# Altium schematic sheet Power Regulator.SchDoc: System Power Regulators & GSM IoT Power Switch
size A4; SheetNumber: 11; SheetTotal: 37
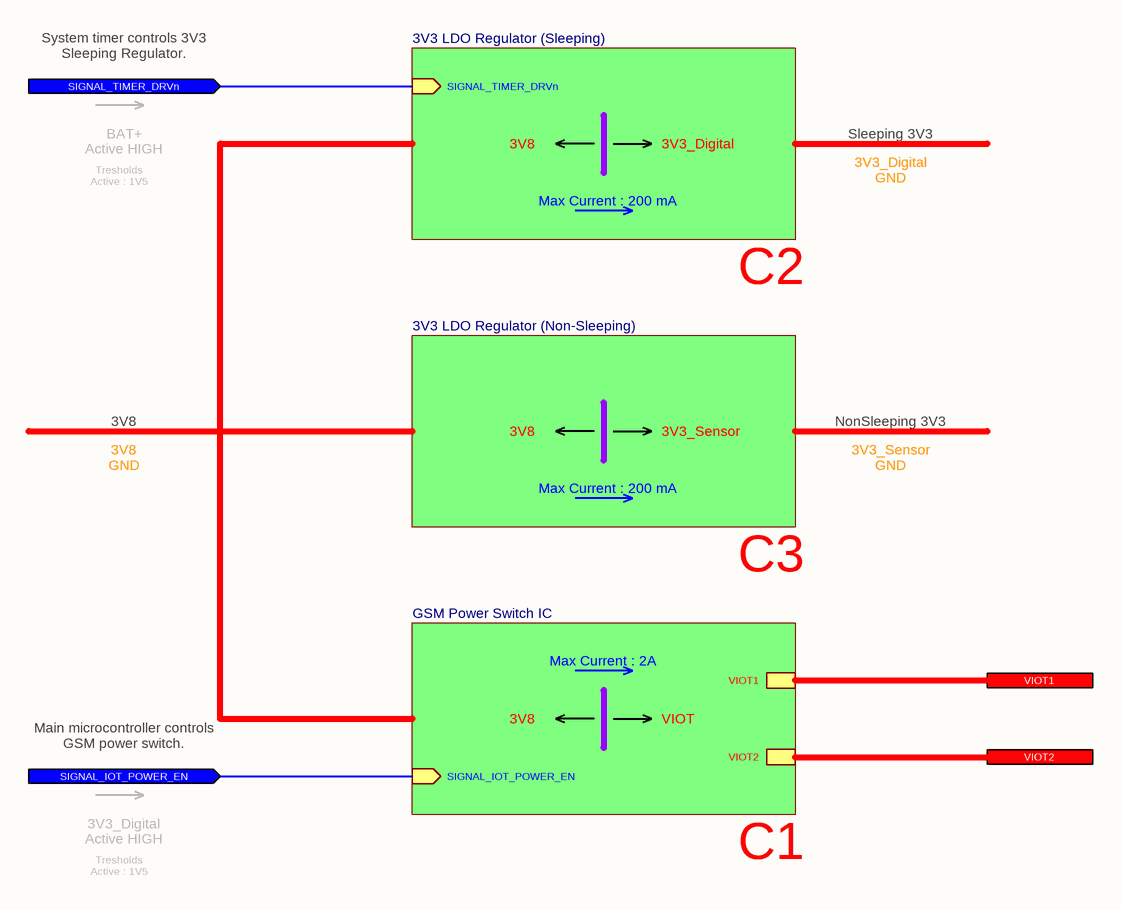
[diagram p0: Power Regulator.SchDoc]

## Sub-sheets
3V3 LDO Regulator (Non-Sleeping) = 3V3 LDO Regulator (NonSleeping).SchDoc: no entries
3V3 LDO Regulator (Sleeping) = 3V3 LDO Regulator (Sleeping).SchDoc: SIGNAL_TIMER_DRVn (in)
GSM Power Switch IC = GSM Power On-Off Switch IC.SchDoc: SIGNAL_IOT_POWER_EN (in), VIOT2, VIOT1

## Ports
SIGNAL_IOT_POWER_EN (in), SIGNAL_TIMER_DRVn (in), VIOT1, VIOT2

## Nets
SIGNAL_IOT_POWER_EN: port SIGNAL_IOT_POWER_EN, sheet GSM Power Switch IC/SIGNAL_IOT_POWER_EN
SIGNAL_TIMER_DRVn: port SIGNAL_TIMER_DRVn, sheet 3V3 LDO Regulator (Sleeping)/SIGNAL_TIMER_DRVn
VIOT1: port VIOT1, sheet GSM Power Switch IC/VIOT1
VIOT2: port VIOT2, sheet GSM Power Switch IC/VIOT2

## Notes on the sheet
- System timer controls 3V3 Sleeping Regulator.
- BAT+
  Active HIGH
- 3V8
- 3V3_Digital
- Sleeping 3V3
- Tresholds
  Active : 1V5
- Max Current : 200 mA
- 3V3_Digital
  GND
- C2
- 3V8
  GND
- 3V3_Sensor
- NonSleeping 3V3
- 3V3_Sensor
  GND
- C3
- Max Current : 2A
- VIOT
- Main microcontroller controls GSM power switch.
- 3V3_Digital
  Active HIGH
- C1
- Title
- Size:
- Date:
- A4
- Number:
- Time:
- Revision:
- Sheet
- of
- File: